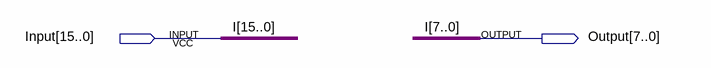
[diagram p0: schematic sheet]
// Quartus schematic 16bitto8bit.bdf as structural Verilog: 0 symbols, 2 pins
module \16bitto8bit  (
  input  [15:0] Input,
  output [7:0] Output
);


  assign Output = Input[7:0];

  // Other names for the same wires on the sheet: I[15:0] = Input
endmodule
